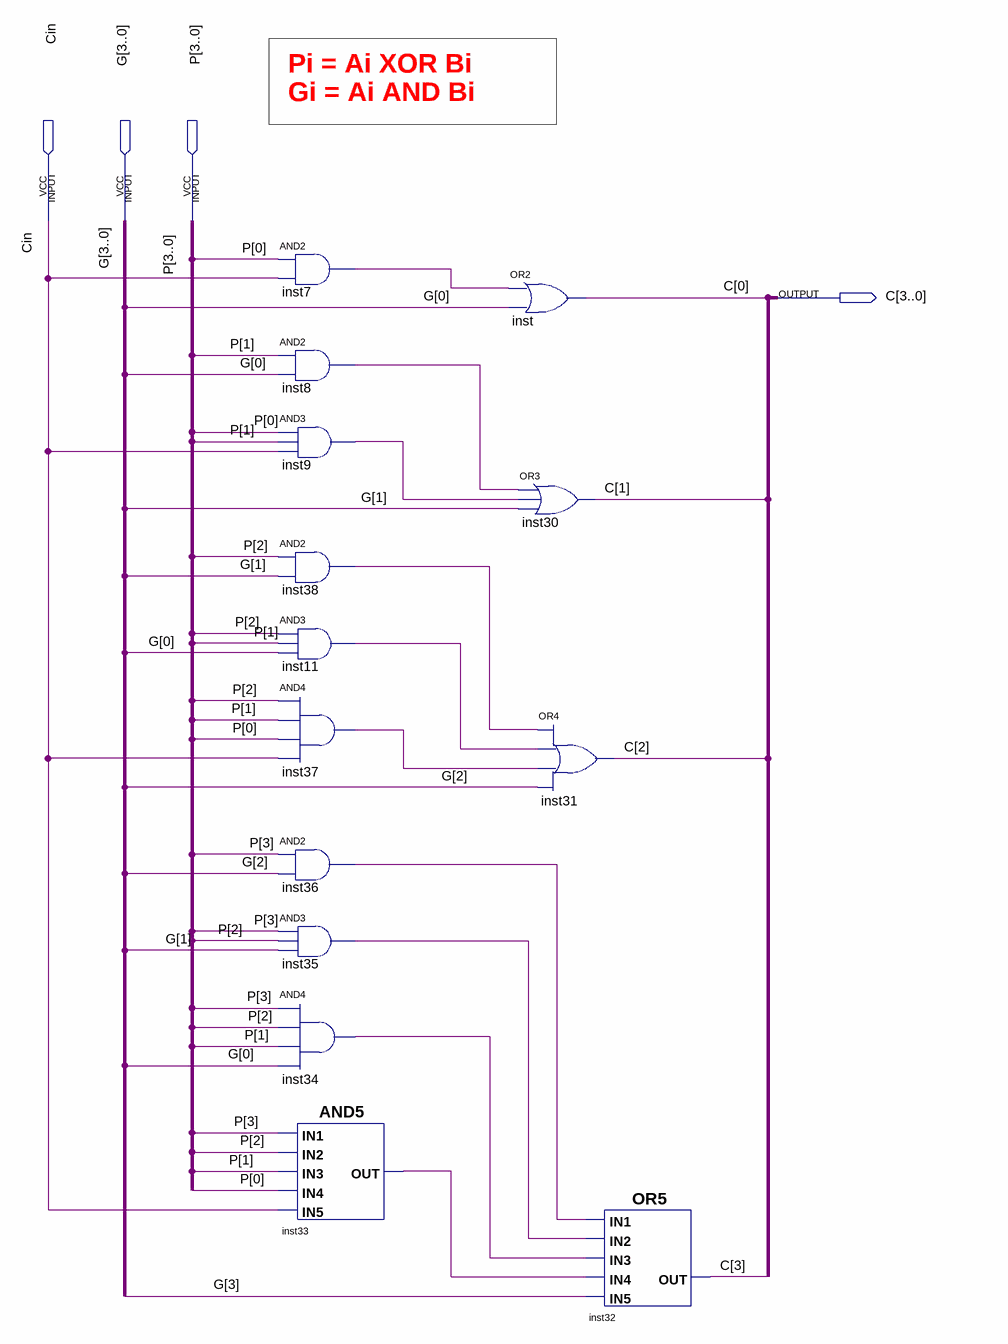
[diagram p0: schematic sheet]
// Quartus schematic CLA.bdf as structural Verilog: 14 symbols, 4 pins
module CLA (
  input  Cin,
  input  [3:0] G,
  input  [3:0] P,
  output [3:0] C
);

  wire inst7_out, inst8_out, inst9_out, inst11_out, inst33_out, inst34_out, inst35_out, inst36_out,
       inst37_out, inst38_out;

  and inst7 (inst7_out, P[0], Cin);
  and inst8 (inst8_out, P[1], G[0]);
  and inst9 (inst9_out, P[0], P[1], Cin);
  and inst38 (inst38_out, P[2], G[1]);
  and inst11 (inst11_out, P[2], P[1], G[0]);
  and inst37 (inst37_out, P[2], P[1], P[0], Cin);
  and inst36 (inst36_out, P[3], G[2]);
  and inst35 (inst35_out, P[3], P[2], G[1]);
  and inst34 (inst34_out, P[3], P[2], P[1], G[0]);
  and inst33 (inst33_out, P[3], P[2], P[1], P[0], Cin);
  or inst (C[0], inst7_out, G[0]);
  or inst30 (C[1], inst8_out, inst9_out, G[1]);
  or inst31 (C[2], inst38_out, inst11_out, inst37_out, G[2]);
  or inst32 (C[3], inst36_out, inst35_out, inst34_out, inst33_out, G[3]);

  // Notes on the sheet:
  //   Pi = Ai XOR Bi
  //   Gi = Ai AND Bi
endmodule
